# EAGLE design PIC795 Brain Board (EAGLE 6.6.0)
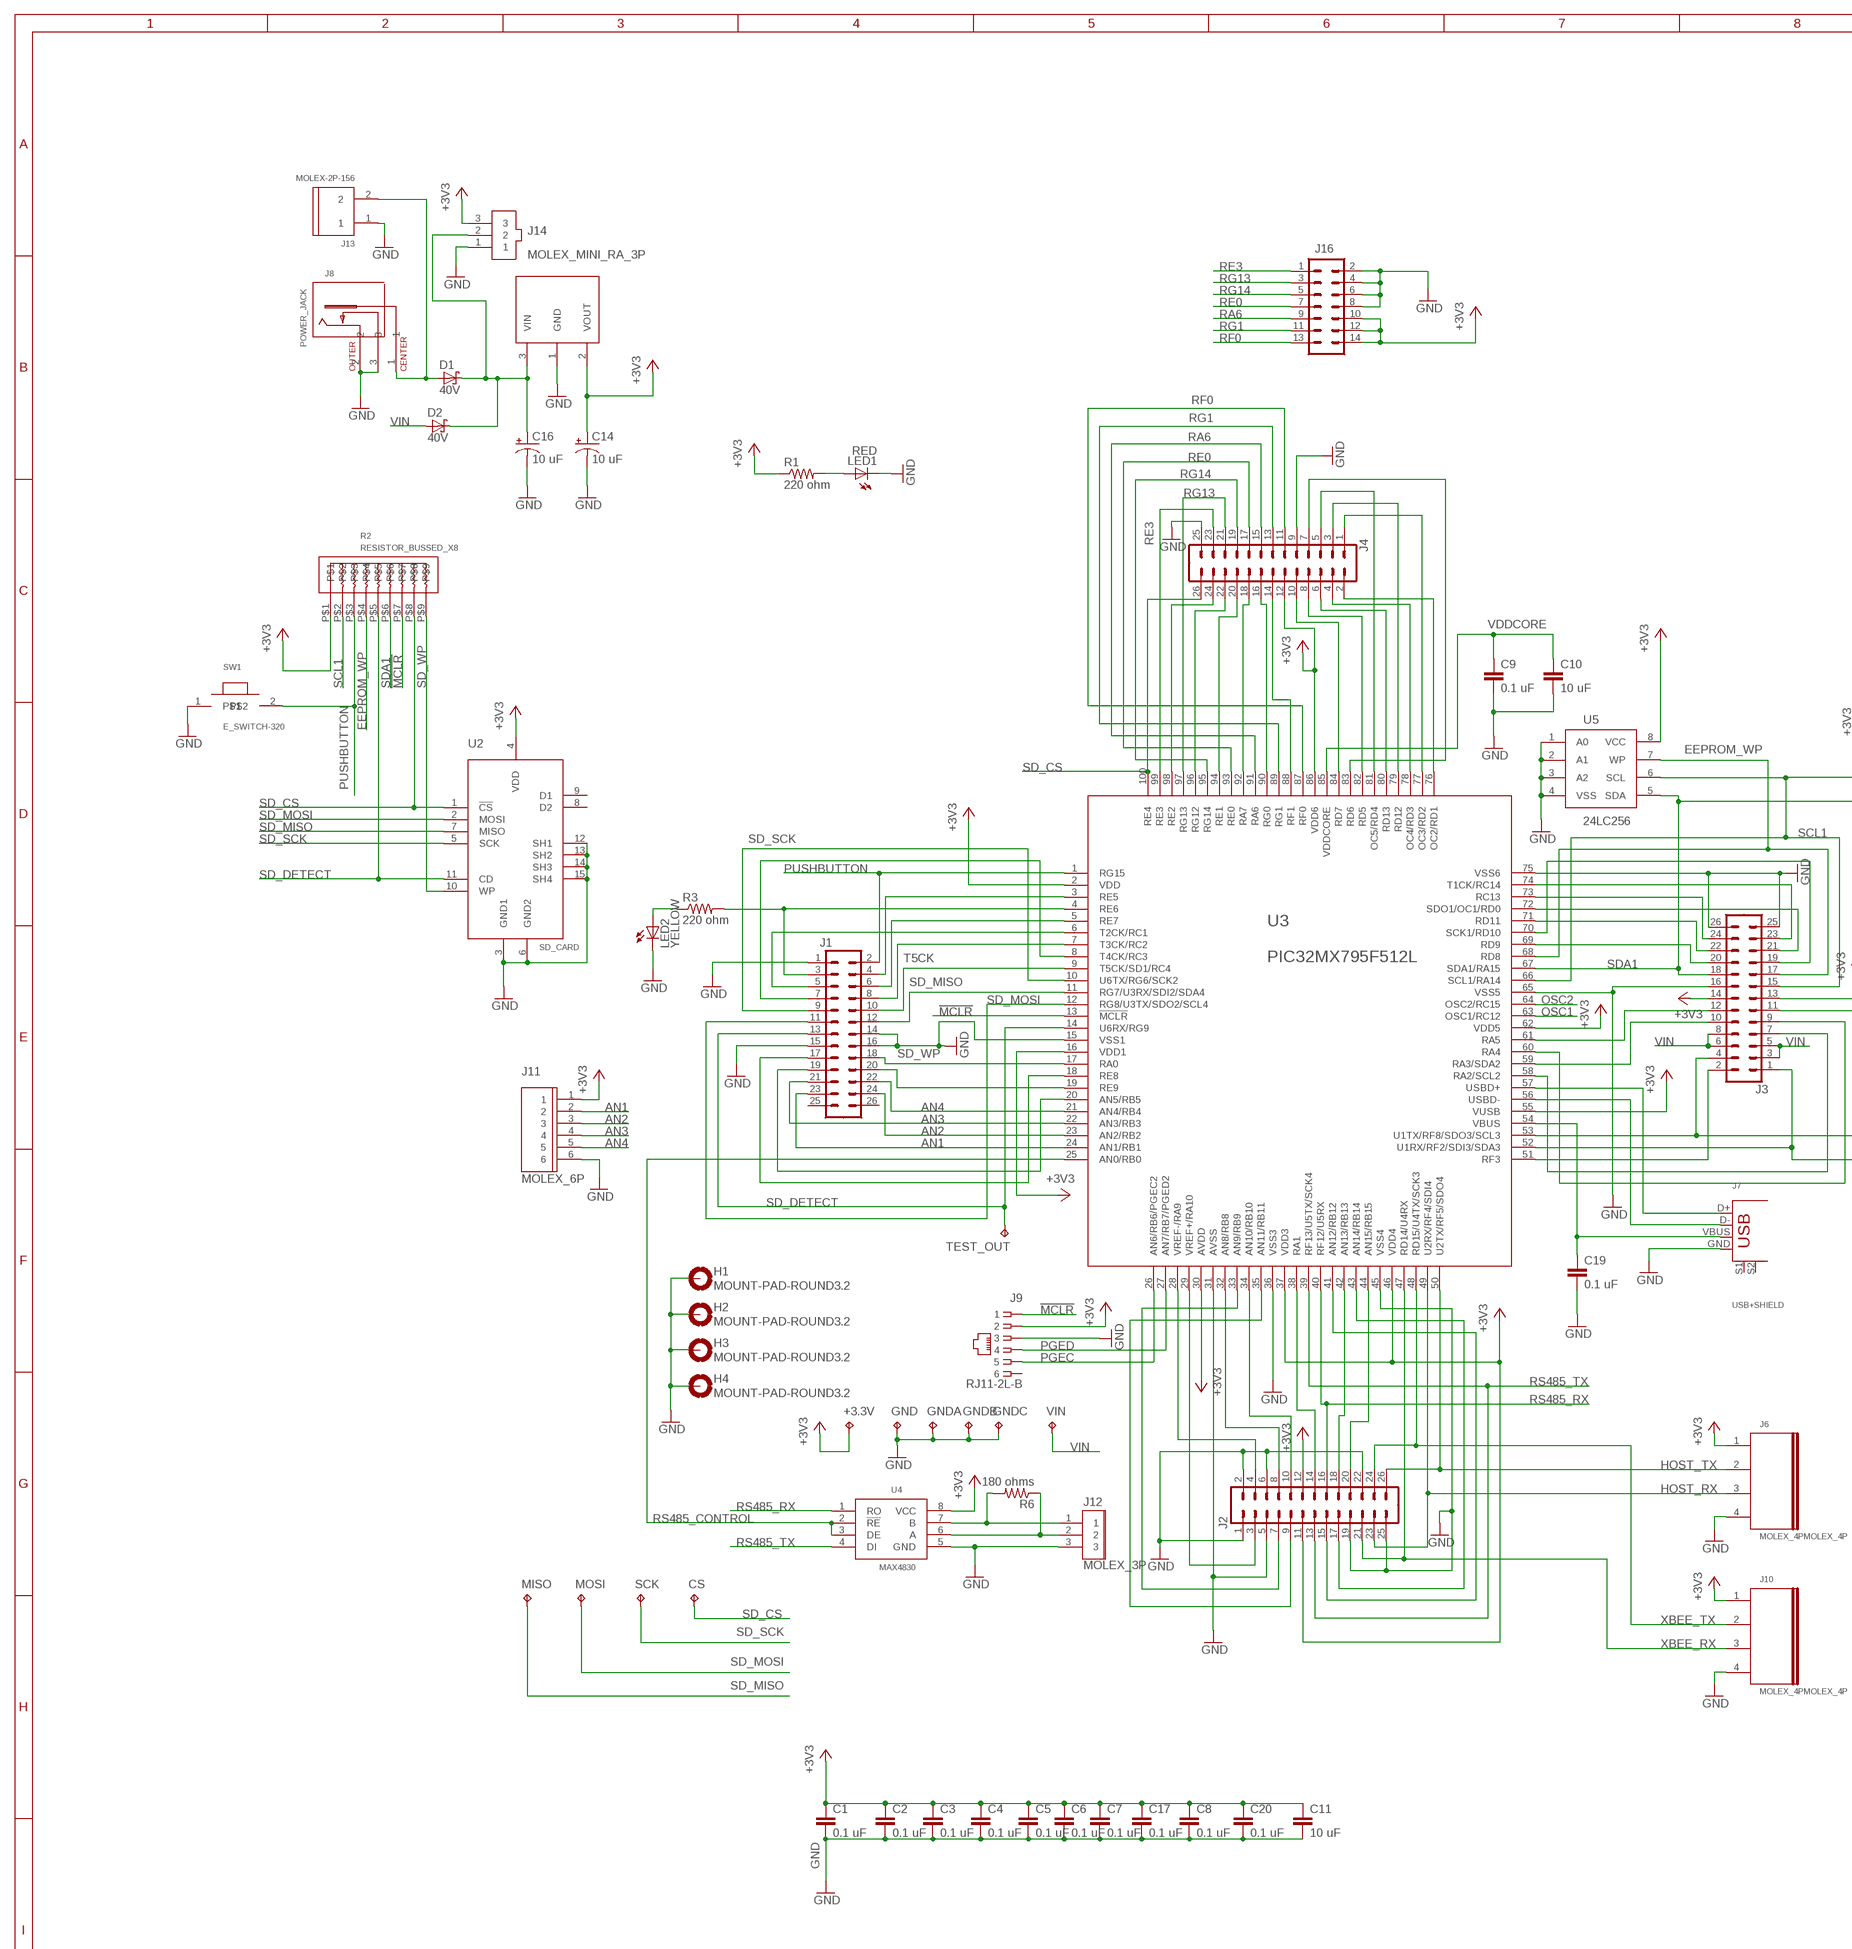
[diagram p0: schematic, sheet 1, part 1 of 2]
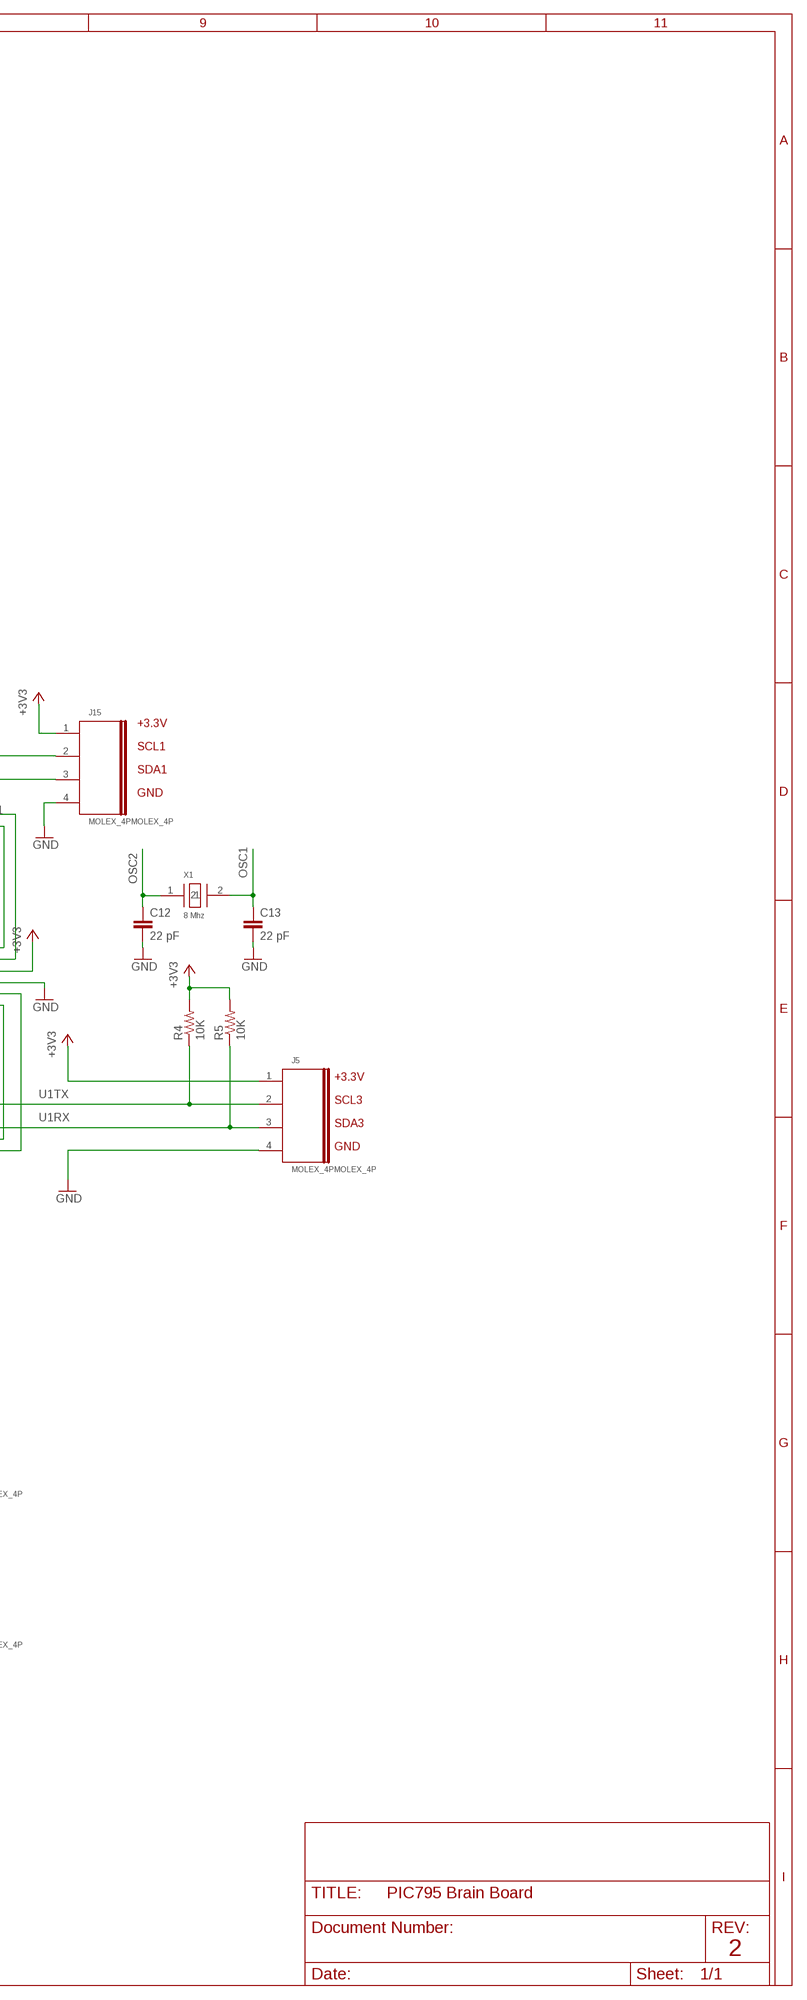
[diagram p1: schematic, sheet 1, part 2 of 2]

## Parts
+3.3V  TP  [TESTPAD]
C1  0.1 uF  CAP-1206  [1206]
C2  0.1 uF  CAP-1206  [1206]
C3  0.1 uF  CAP-1206  [1206]
C4  0.1 uF  CAP-1206  [1206]
C5  0.1 uF  CAP-1206  [1206]
C6  0.1 uF  CAP-1206  [1206]
C7  0.1 uF  CAP-1206  [1206]
C8  0.1 uF  CAP-1206  [1206]
C9  0.1 uF  CAP-1206  [1206]
C10  10 uF  CAP-1206  [1206]
C11  10 uF  CAP-1206  [1206]
C12  22 pF  C0805  [C0805]
C13  22 pF  C0805  [C0805]
C14  10 uF  POLCAPE2.5-5  [E2,5-5]
C16  10 uF  POLCAPE2.5-5  [E2,5-5]
C17  0.1 uF  CAP-1206  [1206]
C19  0.1 uF  C5/2.5  [C5B2.5]
C20  0.1 uF  C5/2.5  [C5B2.5]
CS  TP  [TESTPAD]
D1  40V  1N5817-B  [DO41-7.6]
D2  40V  1N5817-B  [DO41-7.6]
GND  TP  [TESTPAD]
GNDA  TP  [TESTPAD]
GNDB  TP  [TESTPAD]
GNDC  TP  [TESTPAD]
H1  MOUNT-PAD-ROUND3.2  [3,2-PAD]
H2  MOUNT-PAD-ROUND3.2  [3,2-PAD]
H3  MOUNT-PAD-ROUND3.2  [3,2-PAD]
H4  MOUNT-PAD-ROUND3.2  [3,2-PAD]
J1  M13X22X13  [2X13]
J2  M13X22X13  [2X13]
J3  M13X22X13  [2X13]
J4  M13X22X13  [2X13]
J5  MOLEX_4PMOLEX_4P  [MOLEX_4P]
J6  MOLEX_4PMOLEX_4P  [MOLEX_4P]
J7  USB+SHIELD  [USB-B-PTH]
J8  POWER_JACK  [POWER_JACK_PJ-202A]
J9  RJ11-2L-B  [RJ11-NO_SHIELD]
J10  MOLEX_4PMOLEX_4P  [MOLEX_4P]
J11  MOLEX_6P  [MOLEX_6P_SLIM]
J12  MOLEX_3P  [MOLEX_3P]
J13  MOLEX-2P-156  [MOLEX-156-2P]
J14  MOLEX_MINI_RA_3P  [MOLEX_MINI_RA_3P]
J15  MOLEX_4PMOLEX_4P  [MOLEX_4P]
J16  CONNECTOR_DUAL_ROW_14  [2X7]
LED1  RED  LED5MM  [LED5MM]
LED2  YELLOW  LED5MM  [LED5MM]
MISO  TP  [TESTPAD]
MOSI  TP  [TESTPAD]
R1  220 ohm  RESISTOR0207/12  [1/4_WATT]
R2  RESISTOR_BUSSED_X8  [RESISTOR_BUSSED]
R3  220 ohm  RESISTOR0207/12  [1/4_WATT]
R4  10K  RESISTOR0207/12  [1/4_WATT]
R5  10K  RESISTOR0207/12  [1/4_WATT]
R6  180 ohms  RESISTOR0204/7  [0204/7]
SCK  TP  [TESTPAD]
SW1  E_SWITCH-320  [E_SWITCH_320]
TEST_OUT  TP  [TESTPAD]
U1  REGULATOR_LD1086_LDO  [D2PAK]
U2  SD_CARD  [SD_CARD_TE_2041021]
U3  PIC32MX795F512L  [TQFP-100-14X14MM]
U4  MAX4830  MAX485  [SOICN]
U5  24LC256  EEPROM_24LC256  [DIL08]
VIN  TP  [TESTPAD]
X1  8 Mhz  CRYSTAL-SMD  [CRYSTAL-SMD]

## Nets
!MCLR: J9.1 R2.P$7 U3.13(!MCLR)
+3V3: +3.3V.P$1(TP) C1.A C2.A C3.A C4.A C5.A C6.A C7.A C8.A C11.A C14.+ C17.A C20.1 J2.11 J2.12 J3.13 J3.14 J4.12 J5.1 J6.1 J9.2 J10.1 J11.1 J14.3 J15.1 J16.10 J16.12 J16.14 R1.1 R2.P$1 R4.2 R5.2 U1.2(VOUT) U2.4(VDD) U3.2(VDD) U3.16(VDD1) U3.30(AVDD) U3.37(VDD3) U3.46(VDD4) U3.55(VUSB) U3.62(VDD5) U3.86(VDD6) U4.8(VCC) U5.8(VCC)
AN1: J1.23 J11.2 U3.24(AN1/RB1)
AN2: J1.24 J11.3 U3.23(AN2/RB2)
AN3: J1.21 J11.4 U3.22(AN3/RB3)
AN4: J1.22 J11.5 U3.21(AN4/RB4)
EEPROM_WP: J3.17 R2.P$4 U3.68(RD8) U5.7(WP)
GND: C1.C C2.C C3.C C4.C C5.C C6.C C7.C C8.C C9.C C10.C C11.C C12.2 C13.2 C14.- C16.- C17.C C19.2 C20.2 GND.P$1(TP) GNDA.P$1(TP) GNDB.P$1(TP) GNDC.P$1(TP) H1.B3,2(MOUNT) H2.B3,2(MOUNT) H3.B3,2(MOUNT) H4.B3,2(MOUNT) J1.1 J1.14 J1.15 J1.16 J2.1 J2.2 J2.5 J2.6 J2.19 J2.22 J2.25 J3.11 J3.16 J3.25 J3.26 J4.9 J4.25 J5.4 J6.4 J7.GND J8.2 J8.3 J9.3 J10.4 J11.6 J12.3 J13.1 J14.1 J15.4 J16.2 J16.4 J16.6 J16.8 LED1.K(C) LED2.K(C) SW1.1 U1.1(GND) U2.3(GND1) U2.6(GND2) U2.12(SH1) U2.13(SH2) U2.14(SH3) U2.15(SH4) U3.15(VSS1) U3.31(AVSS) U3.36(VSS3) U3.45(VSS4) U3.65(VSS5) U3.75(VSS6) U4.5(GND) U5.1(A0) U5.2(A1) U5.3(A2) U5.4(VSS)
HOST_RX: J2.23 J6.3 U3.49(U2RX/RF4/SDI4)
HOST_TX: J2.26 J6.2 U3.50(U2TX/RF5/SDO4)
N$1: J3.2 U3.51(RF3)
N$2: LED2.A R3.1
N$3: J2.8 U3.32(AN8/RB8)
N$4: J7.D+ U3.57(USBD+)
N$5: J3.10 U3.59(RA3/SDA2)
N$6: J3.12 U3.61(RA5)
N$7: D1.A J8.1 J13.2
N$8: C16.+ D1.C D2.C J14.2 U1.3(VIN)
N$10: J3.20 U3.69(RD9)
N$11: J3.22 U3.71(RD11)
N$12: J3.24 U3.73(RC13)
N$15: C19.1 J7.VBUS U3.54(VBUS)
N$16: J7.D- U3.56(USBD-)
N$17: J3.7 U3.58(RA2/SCL2)
N$18: J3.9 U3.60(RA4)
N$19: J3.23 U3.74(T1CK/RC14)
N$20: J3.21 U3.72(SDO1/OC1/RD0)
N$21: J3.19 U3.70(SCK1/RD10)
N$25: LED1.A R1.2
N$26: J12.1 R6.2 U4.7(B)
N$27: J2.4 U3.28(VREF-/RA9)
N$28: J12.2 R6.1 U4.6(A)
N$30: J2.10 U3.34(AN10/RB10)
N$32: J2.14 U3.38(RA1)
N$34: J2.18 U3.42(AN13/RB13)
N$35: J2.20 U3.44(AN15/RB15)
N$40: J2.3 U3.29(VREF+/RA10)
N$42: J2.7 U3.33(AN9/RB9)
N$43: J2.9 U3.35(AN11/RB11)
N$47: J2.17 U3.43(AN14/RB14)
N$48: J2.15 U3.41(AN12/RB12)
N$51: J4.2 U3.76(OC2/RD1)
N$52: J4.4 U3.78(OC4/RD3)
N$53: J4.6 U3.80(RD13)
N$54: J4.8 U3.82(RD5)
N$55: J4.10 U3.84(RD7)
N$57: J4.14 U3.88(RF1)
N$58: J4.16 U3.90(RG0)
N$59: J4.18 U3.92(RA7)
N$60: J4.20 U3.94(RE1)
N$61: J4.22 U3.96(RG12)
N$62: J4.24 U3.98(RE2)
N$64: J4.1 U3.77(OC3/RD2)
N$65: J4.3 U3.79(RD12)
N$66: J4.5 U3.81(OC5/RD4)
N$67: J4.7 U3.83(RD6)
N$77: J1.4 U3.3(RE5)
N$78: J1.6 U3.5(RE7)
N$79: J1.8 U3.7(T3CK/RC2)
N$85: J1.20 U3.19(RE9)
N$90: J1.3 R3.2 U3.4(RE6)
N$91: J1.5 U3.6(T2CK/RC1)
N$92: J1.7 U3.8(T4CK/RC3)
N$96: J1.19 U3.20(AN5/RB5)
N$97: J1.17 U3.18(RE8)
OSC1: C13.1 U3.63(OSC1/RC12) X1.2
OSC2: C12.1 U3.64(OSC2/RC15) X1.1
PGEC: J9.5 U3.26(AN6/RB6/PGEC2)
PGED: J9.4 U3.27(AN7/RB7/PGED2)
PUSHBUTTON: J1.2 R2.P$3 SW1.2 U3.1(RG15)
RA6: J4.15 J16.9 U3.91(RA6)
RE0: J4.17 J16.7 U3.93(RE0)
RE3: J4.23 J16.1 U3.99(RE3)
RF0: J4.11 J16.13 U3.87(RF0)
RG1: J4.13 J16.11 U3.89(RG1)
RG13: J4.21 J16.3 U3.97(RG13)
RG14: J4.19 J16.5 U3.95(RG14)
RS485_CONTROL: U3.25(AN0/RB0) U4.2(!RE) U4.3(DE)
RS485_RX: J2.16 U3.40(RF12/U5RX) U4.1(RO)
RS485_TX: J2.13 U3.39(RF13/U5TX/SCK4) U4.4(DI)
SCL1: J3.15 J15.2 R2.P$2 U3.66(SCL1/RA14) U5.6(SCL)
SD_CS: CS.P$1(TP) J4.26 R2.P$8 U2.1(!CS) U3.100(RE4)
SD_DETECT: J1.13 R2.P$5 TEST_OUT.P$1(TP) U2.11(CD) U3.14(U6RX/RG9)
SD_MISO: J1.12 MISO.P$1(TP) U2.7(MISO) U3.11(RG7/U3RX/SDI2/SDA4)
SD_MOSI: J1.11 MOSI.P$1(TP) U2.2(MOSI) U3.12(RG8/U3TX/SDO2/SCL4)
SD_SCK: J1.9 SCK.P$1(TP) U2.5(SCK) U3.10(U6TX/RG6/SCK2)
SD_WP: J1.18 R2.P$9 U2.10(WP) U3.17(RA0)
SDA1: J3.18 J15.3 R2.P$6 U3.67(SDA1/RA15) U5.5(SDA)
T5CK: J1.10 U3.9(T5CK/SD1/RC4)
U1RX: J3.1 J5.3 R5.1 U3.52(U1RX/RF2/SDI3/SDA3)
U1TX: J3.4 J5.2 R4.1 U3.53(U1TX/RF8/SDO3/SCL3)
VDDCORE: C9.A C10.A U3.85(VDDCORE)
VIN: D2.A J3.3 J3.5 J3.6 J3.8 VIN.P$1(TP)
XBEE_RX: J2.21 J10.3 U3.47(RD14/U4RX)
XBEE_TX: J2.24 J10.2 U3.48(RD15/U4TX/SCK3)
Unconnected: J1.25 J1.26 J7.S1 J7.S2 J9.6 U2.8(D2) U2.9(D1)

## Notes on the sheet
- +3.3V
- SCL1
- SDA1
- GND
- +3.3V
- SCL3
- SDA3
- GND
- 2

## Library data of the parts
+3.3V CS GND GNDA GNDB GNDC MISO MOSI SCK TEST_OUT VIN = JimLib:TP: Test pad
C1-C11 C17 = JimLib:CAP-1206: CAPACITOR naming: grid - package width
C12 C13 = JimLib:C0805
C14 C16 = JimLib:POLCAP: POLARIZED CAPACITOR, American symbol
C19 C20 = JimLib:C: CAPACITOR naming: grid - package width
D1 D2 = JimLib:1N581*: 1.0A SCHOTTKY BARRIER RECTIFIER Source: http://www.diodes.com/datasheets/ds23001.pdf
H1-H4 = holes:MOUNT-PAD-ROUND: MOUNTING PAD, round
J1-J4 = SparkFun-Connectors:M13X2: 0.1" spaced headers
J5 J6 J10 J15 = JimLib:MOLEX_4P: .100" (2.54mm) Center Header - 3 Pin
J7 = JimLib:USB+SHIELD: USB+Shield USB connector with shield pins connectable
J8 = JimLib:POWER_JACK
J9 = JimLib:RJ11: CORCOM Modular RJ Jacks No Shield Source: www.tycoelectronics.com .. ENG_DS_1654001_1099_RJ_L_0507.pdf; MF: TYCO ELECTRONICS; MPN: RJ11-2L-B; OC_FARNELL: unknown; OC_NEWARK: 83F4463
J11 = JimLib:MOLEX_6P: .100" (2.54mm) Center Header - 3 Pin
J12 = JimLib:MOLEX_3P
J13 = JimLib:MOLEX-2P-156
J14 = JimLib:MOLEX_MINI_RA_3P
J16 = JimLib:CONNECTOR_DUAL_ROW_14: .1" headers, two rows of 8 each
LED1 LED2 = JimLib:LED: LED OSRAM: - CHIPLED LG R971, LG N971, LY N971, LG Q971, LY Q971, LO R971, LY R971 LH N974, LH R974 LS Q976, LO Q976, LY Q976 LO Q996 - Hyper CHIPLED LW Q18S LB Q993, LB Q99A, LB R99A - SideLED LS A670, LO A670, LY A670, LG A670, LP A670 LB A673, LV A673, LT A673, LW A673 LH A674 LY A675 LS A676, LA A676, LO A676, LY A676, LW A676 LS A679, LY A679, LG A679 - Hyper Micro SIDELED® LS Y876, LA Y876, LO Y876, LY Y876 LT Y87S - SmartLED LW L88C, LW L88S LB L89C, LB L89S, LG L890 LS L89K, LO L89K, LY L89K LS L896, LA L896, LO L896, LY L896 - TOPLED LS T670, LO T670, LY T670, LG T670, LP T670 LSG T670, LSP T670, LSY T670, LOP T670, LYG T670 LG T671, LOG T671, LSG T671 LB T673, LV T673, LT T673, LW T673 LH T674 LS T676, LA T676, LO T676, LY T676, LB T676, LH T676, LSB T676, LW T676 LB T67C, LV T67C, LT T67C, LS T67K, LO T67K, LY T67K, LW E67C LS E67B, LA E67B, LO E67B, LY E67B, LB E67C, LV E67C, LT E67C LW T67C LS T679, LY T679, LG T679 LS T770, LO T770, LY T770, LG T770, LP T770 LB T773, LV T773, LT T773, LW T773 LH T774 LS E675, LA E675, LY E675, LS T675 LS T776, LA T776, LO T776, LY T776, LB T776 LHGB T686 LT T68C, LB T68C - Hyper Mini TOPLED® LB M676 - Mini TOPLED Santana® LG M470 LS M47K, LO M47K, LY M47K Source: http://www.osram.convergy.de LUXEON: - LUMILED® LXK2-PW12-R00, LXK2-PW12-S00, LXK2-PW14-U00, LXK2-PW14-V00 LXK2-PM12-R00, LXK2-PM12-S00, LXK2-PM14-U00 LXK2-PE12-Q00, LXK2-PE12-R00, LXK2-PE12-S00, LXK2-PE14-T00, LXK2-PE14-U00 LXK2-PB12-K00, LXK2-PB12-L00, LXK2-PB12-M00, LXK2-PB14-N00, LXK2-PB14-P00, LXK2-PB14-Q00 LXK2-PR12-L00, LXK2-PR12-M00, LXK2-PR14-Q00, LXK2-PR14-R00 LXK2-PD12-Q00, LXK2-PD12-R00, LXK2-PD12-S00 LXK2-PH12-R00, LXK2-PH12-S00 LXK2-PL12-P00, LXK2-PL12-Q00, LXK2-PL12-R00 Source: www.luxeon.com KINGBRIGHT: KA-3528ASYC Source: www.kingbright.com
R1 R3-R6 = JimLib:RESISTOR: RESISTOR, American symbol
R2 = JimLib:RESISTOR_BUSSED_X8
SW1 = JimLib:E_SWITCH-320: Single pole momentary normally off E Switch 320 Series
U1 = JimLib:REGULATOR_LD1086_LDO
U2 = JimLib:SD_CARD
U3 = JimLib:PIC32MX795F512L
U4 = JimLib:MAX485
U5 = JimLib:EEPROM_24LC256
X1 = JimLib:CRYSTAL-SMD

## Board
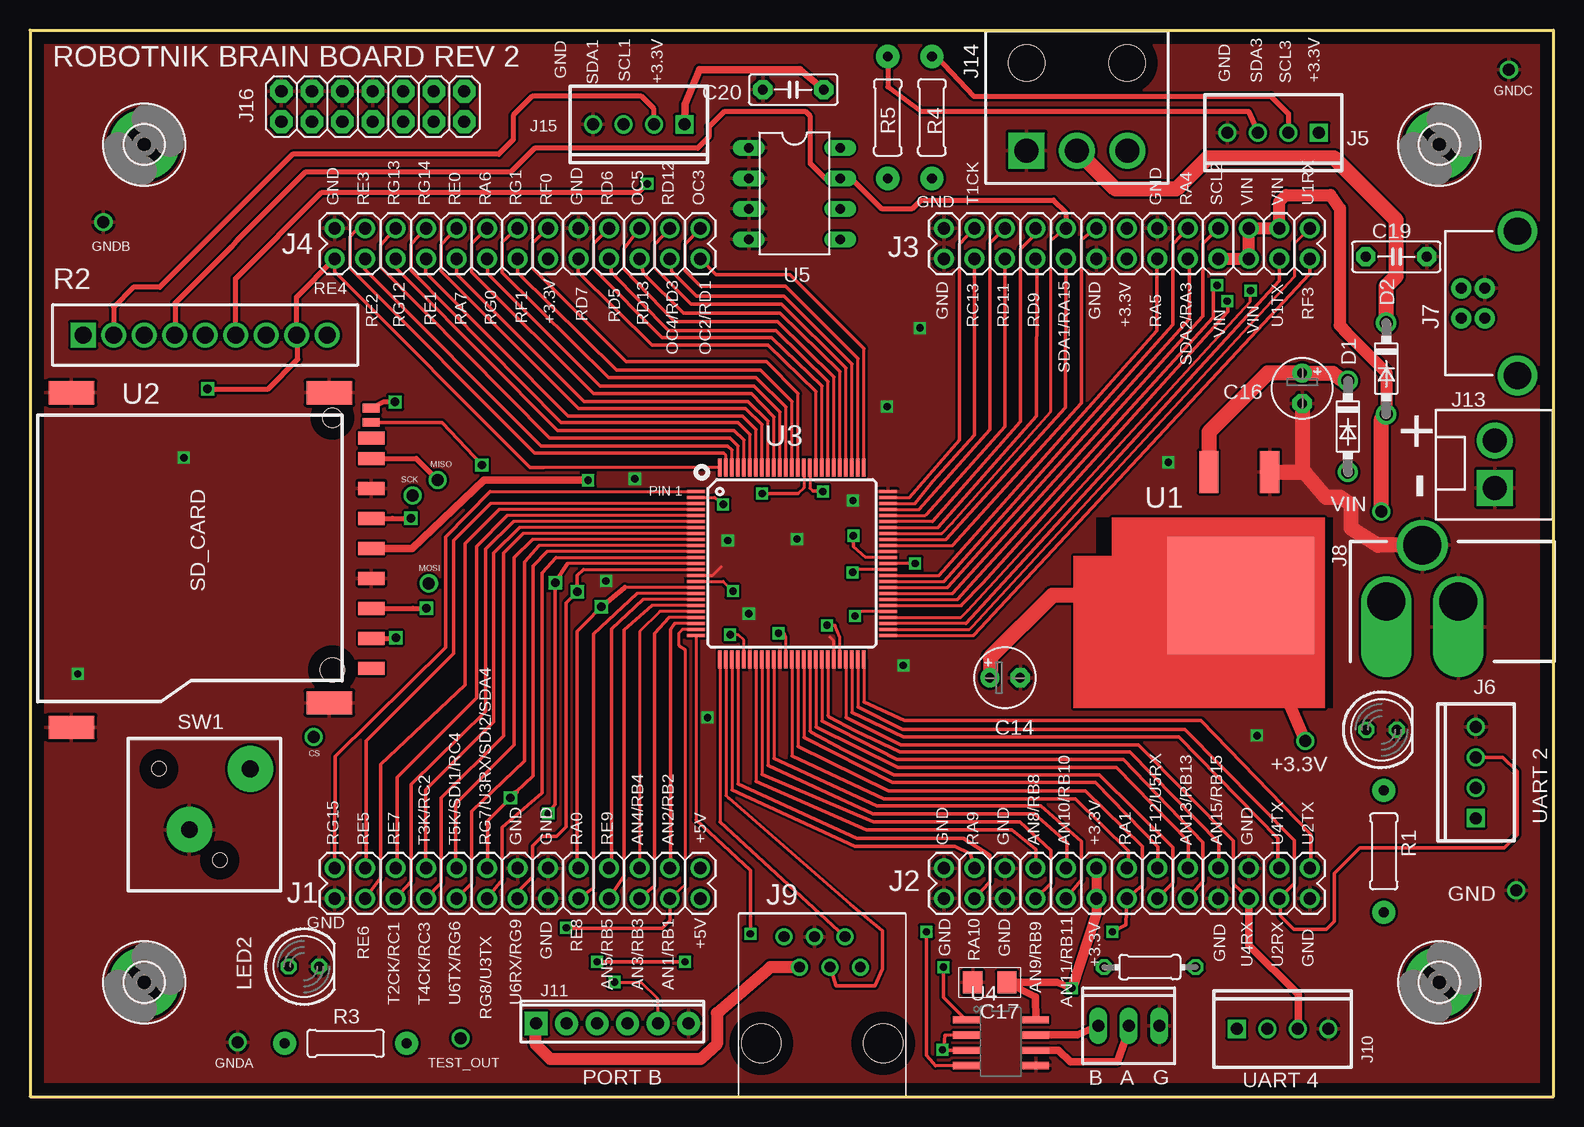
[diagram p2: board, top side]
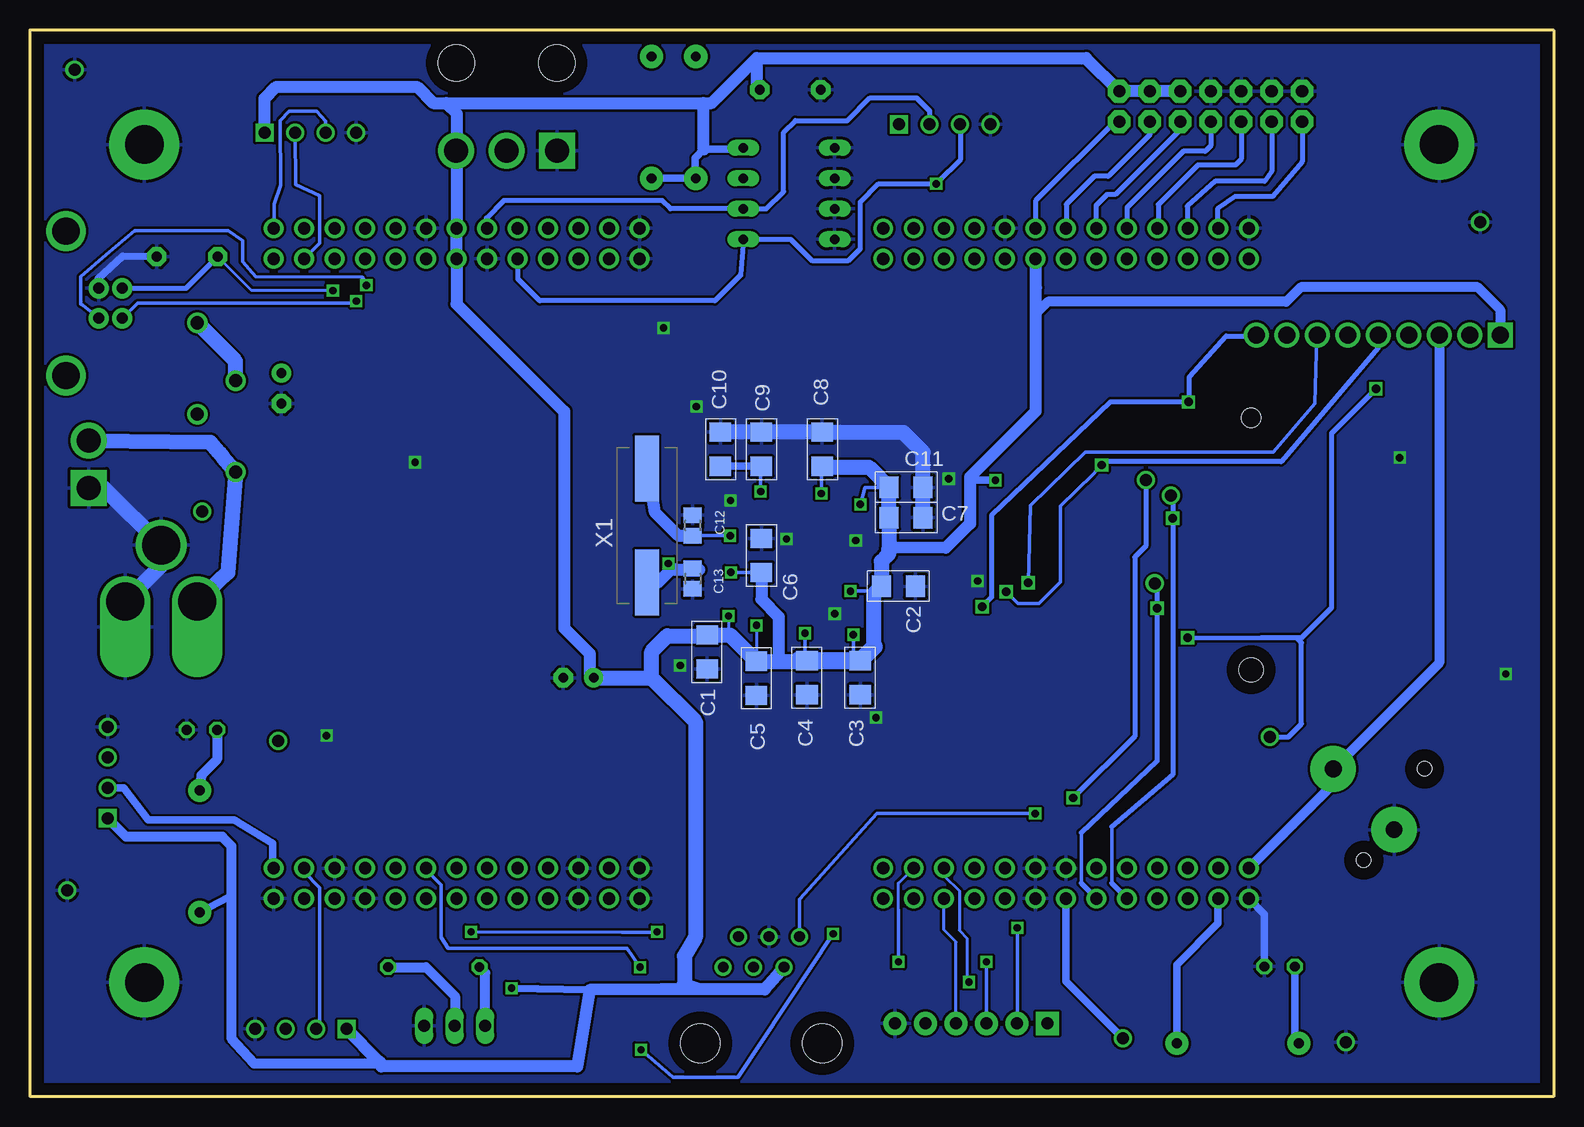
[diagram p3: board, bottom side, seen from below]

Size 127 x 88.93 mm. Coordinates in mm from the lower left corner, seen from the top.
Outline: 127,88.9 127,0 0,0 0,88.9
Outline: 0,88.92 127,88.92
Copper layers (1*16): Top 0.035mm / dielectric 1.5mm / Bottom 0.035mm
Design rules "default *": minimum track width 10mil, minimum drill 19mil, track to track 8mil, track to pad 8mil, pad to pad 8mil, via to via 8mil, smd to smd 8mil, copper to edge 40mil, drill to drill 8mil, minimum pad ring 10mil, minimum via ring 8mil, stop-mask expansion 4mil, vias tented up to drill 0mil, thermal gap 10mil
tRestrict: area 88.9,32.4 to 108.6,48.3

### Footprints (pad centres in the part's own frame; a part is rotated, then mirrored left to right if it is on the bottom)
TESTPAD = drill 1: P$1 0,0
1206 = smd 1.6 x 1.803: A -1.422,0; C 1.422,0
C0805 = smd 1.3 x 1.5: 1 -0.85,0; 2 0.85,0
E2,5-5 = drill 0.813 pad 1.6: + -1.27,0 | drill 0.813 pad 1.6 octagon: - 1.27,0
C5B2.5 = drill 0.813 pad 1.6 octagon: 1 -2.54,0; 2 2.54,0
DO41-7.6 = drill 1.1 pad 1.7: A 3.81,0; C -3.81,0
3,2-PAD = drill 3.2 pad 5.842: B3,2 0,0
2X13 = drill 1.016 pad 1.651: 1 0,0; 2 0,2.54; 3 2.54,0; 4 2.54,2.54; 5 5.08,0; 6 5.08,2.54; 7 7.62,0; 8 7.62,2.54; 9 10.16,0; 10 10.16,2.54; 11 12.7,0; 12 12.7,2.54; 13 15.24,0; 14 15.24,2.54; 15 17.78,0; 16 17.78,2.54; 17 20.32,0; 18 20.32,2.54; 19 22.86,0; 20 22.86,2.54; 21 25.4,0; 22 25.4,2.54; 23 27.94,0; 24 27.94,2.54; 25 30.48,0; 26 30.48,2.54
MOLEX_4P = drill 1 square: 1 -3.81,0 | drill 1: 2 -1.27,0; 3 1.27,0; 4 3.81,0
USB-B-PTH = drill 0.914 pad 1.676: D+ 0,1.25; D- 1.981,1.25; GND 0,-1.25; VBUS 1.981,-1.25 | drill 2.286: S1 -2.718,-6.02; S2 -2.718,6.02
POWER_JACK_PJ-202A = drill 3.2 offset: 1 0,0; 2 0,6 | drill 3.2: 3 -4.7,3
RJ11-NO_SHIELD = drill 0.9 pad 1.4: 1 -3.175,8.89; 2 -1.905,6.35; 3 -0.635,8.89; 4 0.635,6.35; 5 1.905,8.89; 6 3.175,6.35 | hole 3.251: -5.08,0; 5.08,0
MOLEX_6P_SLIM = drill 1 pad 1.93 square: 1 -3.81,0 | drill 1 pad 1.93: 2 -1.27,0; 3 1.27,0; 4 3.81,0; 5 6.35,0; 6 8.89,0
MOLEX_3P = drill 1 long: 1 -2.54,0; 2 0,0; 3 2.54,0
MOLEX-156-2P = drill 2 square: 1 -1.981,0 | drill 2: 2 1.981,0
MOLEX_MINI_RA_3P = drill 2 square: 1 4.2,-2.75 | drill 2: 2 0,-2.75; 3 -4.2,-2.75 | hole 3: 4.191,-10.046; -4.191,-10.046
2X7 = drill 1.016 pad 1.88 octagon: 1 0,0; 2 0,2.54; 3 2.54,0; 4 2.54,2.54; 5 5.08,0; 6 5.08,2.54; 7 7.62,0; 8 7.62,2.54; 9 10.16,0; 10 10.16,2.54; 11 12.7,0; 12 12.7,2.54; 13 15.24,0; 14 15.24,2.54
LED5MM = drill 0.813 octagon: A -1.27,0; K 1.27,0
1/4_WATT = drill 0.813 pad 1.93: 1 -5.08,0; 2 5.08,0
RESISTOR_BUSSED = drill 1.4 square: P$1 0,0 | drill 1.4: P$2 2.54,0; P$3 5.08,0; P$4 7.62,0; P$5 10.16,0; P$6 12.7,0; P$7 15.24,0; P$8 17.78,0; P$9 20.32,0
0204/7 = drill 0.813 octagon: 1 -3.81,0; 2 3.81,0
E_SWITCH_320 = drill 1.4 pad 3.81: 1 -2.54,-2.54; 2 2.54,2.54 | hole 1.2: -5.08,2.54; 0,-5.08
D2PAK = smd 1.6 x 3.5: 1 -2.54,-10.275; 3 2.54,-10.275 | smd 12.2 x 9.75: 2 -0.1,0
SD_CARD_TE_2041021 = smd 1.067 x 2.184: 1 6.88,12.58; 2 4.38,12.58; 3 1.88,12.58; 4 -0.62,12.58; 5 -3.12,12.58; 6 -5.62,12.58; 7 -8.12,12.58; 8 -9.82,12.58; 9 9.38,12.58 | smd 0.711 x 1.422: 10 -12.32,12.58; 11 -11.12,12.58 | smd 1.93 x 3.81: 12 12.255,9.08; 13 14.305,-12.42; 14 -13.595,-12.42; 15 -13.595,9.08 | hole 2: 9.505,9.33 | hole 1.6: -11.495,9.33
TQFP-100-14X14MM = smd 1.5 x 0.27: 1 -8,6; 2 -8,5.5; 3 -8,5; 4 -8,4.5; 5 -8,4; 6 -8,3.5; 7 -8,3; 8 -8,2.5; 9 -8,2; 10 -8,1.5; 11 -8,1; 12 -8,0.5; 13 -8,0; 14 -8,-0.5; 15 -8,-1; 16 -8,-1.5; 17 -8,-2; 18 -8,-2.5; 19 -8,-3; 20 -8,-3.5; 21 -8,-4; 22 -8,-4.5; 23 -8,-5; 24 -8,-5.5; 25 -8,-6; 51 8,-6; 52 8,-5.5; 53 8,-5; 54 8,-4.5; 55 8,-4; 56 8,-3.5; 57 8,-3; 58 8,-2.5; 59 8,-2; 60 8,-1.5; 61 8,-1; 62 8,-0.5; 63 8,0; 64 8,0.5; 65 8,1; 66 8,1.5; 67 8,2; 68 8,2.5; 69 8,3; 70 8,3.5; 71 8,4; 72 8,4.5; 73 8,5; 74 8,5.5; 75 8,6 | smd 0.27 x 1.5: 26 -6,-8; 27 -5.5,-8; 28 -5,-8; 29 -4.5,-8; 30 -4,-8; 31 -3.5,-8; 32 -3,-8; 33 -2.5,-8; 34 -2,-8; 35 -1.5,-8; 36 -1,-8; 37 -0.5,-8; 38 0,-8; 39 0.5,-8; 40 1,-8; 41 1.5,-8; 42 2,-8; 43 2.5,-8; 44 3,-8; 45 3.5,-8; 46 4,-8; 47 4.5,-8; 48 5,-8; 49 5.5,-8; 50 6,-8; 76 6,8; 77 5.5,8; 78 5,8; 79 4.5,8; 80 4,8; 81 3.5,8; 82 3,8; 83 2.5,8; 84 2,8; 85 1.5,8; 86 1,8; 87 0.5,8; 88 0,8; 89 -0.5,8; 90 -1,8; 91 -1.5,8; 92 -2,8; 93 -2.5,8; 94 -3,8; 95 -3.5,8; 96 -4,8; 97 -4.5,8; 98 -5,8; 99 -5.5,8; 100 -6,8
SOICN = smd 0.6 x 2.2: 1 -1.905,-2.9; 2 -0.635,-2.9; 3 0.635,-2.9; 4 1.905,-2.9; 5 1.905,2.9; 6 0.635,2.9; 7 -0.635,2.9; 8 -1.905,2.9
DIL08 = drill 0.813 long: 1 -3.81,-3.81; 2 -1.27,-3.81; 3 1.27,-3.81; 4 3.81,-3.81; 5 3.81,3.81; 6 1.27,3.81; 7 -1.27,3.81; 8 -3.81,3.81
CRYSTAL-SMD = smd 5.5 x 2: 1 -4.75,0; 2 4.75,0

### Placement (x,y rotation side)
+3.3V  106.3,29.67 0 top
C1  70.55,37.07 270 bottom
C2  54.61,42.55 0 bottom
C3  57.78,34.92 270 bottom
C4  62.23,34.92 270 bottom
C5  66.45,34.87 270 bottom
C6  66.04,45.11 90 bottom
C7  53.98,48.26 0 bottom
C8  60.96,53.98 90 bottom
C9  66.04,53.98 90 bottom
C10  69.44,53.98 90 bottom
C11  53.98,50.8 0 bottom
C12  71.75,47.62 90 bottom
C13  71.75,43.18 270 bottom
C14  81.28,34.92 0 top
C16  106.05,59.05 270 top
C17  80.01,9.53 180 top
C19  113.89,70.03 0 top
C20  63.63,83.95 180 top
CS  23.65,29.97 0 top
D1  109.86,55.88 270 top
D2  113.06,60.71 270 top
GND  123.9,17.2 0 top
GNDA  17.32,4.55 0 top
GNDB  6.12,72.9 0 top
GNDC  123.29,85.62 0 top
H1  9.53,9.53 0 top
H2  9.53,79.38 0 top
H3  117.47,9.53 0 top
H4  117.47,79.38 0 top
J1  25.4,16.51 0 top
J2  76.2,16.51 0 top
J3  106.68,72.39 180 top
J4  55.88,72.39 180 top
J5  103.64,80.36 180 top
J6  120.53,27.02 90 top
J7  121.28,66.14 180 top
J8  113.06,41.28 270 top
J9  66.04,4.45 0 top
J10  104.42,5.63 0 top
J11  46,6.1 0 top
J12  91.59,5.91 0 top
J13  122.12,52.73 90 top
J14  87.27,76.12 180 top
J15  50.75,81.05 180 top
J16  20.95,81.28 0 top
LED1  112.67,30.58 0 top
LED2  22.83,10.85 0 top
MISO  33.99,51.41 0 top
MOSI  33.25,42.8 0 top
R1  112.85,20.45 90 top
R2  4.45,63.5 0 top
R3  26.31,4.45 0 top
R4  75.18,81.64 270 top
R5  71.5,81.64 270 top
R6  93.34,10.79 180 top
SCK  31.9,50.11 0 top
SW1  15.82,24.79 0 top
TEST_OUT  35.89,4.85 0 top
U1  100.8,41.8 180 top
U2  15.88,45.09 270 top
U3  63.5,44.45 0 top
U4  80.94,4.5 270 top
U5  63.73,75.29 270 top
VIN  112.65,48.79 0 top
X1  75.56,47.62 270 bottom

### Tracks (layer width: path | path; a pad name or v marks a point on that pad's centre or on a via)
!MCLR  (via drill 0.6, 0.7)
  Top 0.254: U3.13 44.83,44.45
  Top 0.305: 44.83,44.45 v43.79,42.85 43.79,24.36 v43.2,23.6
  Bottom 0.305: v43.2,23.6 56.39,23.6 62.87,16.46 J9.1 | v43.79,42.85 43.61,49.28 39.04,53.75 23.34,53.75 19.89,57.78 19.74,63.45 R2.P$7
+3V3  (via drill 0.6)
  Top 0.254: U3.62 68.72,43.95 v68.58,43.71 | U3.55 69.15,40.45 v68.78,40.08 | U3.2 57.06,49.95 v57.78,49.38 | U3.86 64.5,50.76 64.01,50.27 | U3.16 57.79,42.95 v58.6,42.14 | U3.30 59.5,38.06 59.05,38.51 v58.37,38.51 | U3.37 63,38.27 62.89,38.63 v62.41,38.63 | U3.46 67.5,38.27 67.11,39.29 v66.45,39.29
  Top 0.305: 64.01,50.27 61.06,50.27 v61.04,50.29
  Top 0.61: U4.8 83.81,8.32 C17.A 85.62,9.53 v86.84,9.04 | U2.4 31.86,45.7 37.85,51.38 v46.53,51.38 | J15.1 54.59,82.75 55.8,85.62 64.19,85.62 C20.1
  Top 0.813: J2.12 J2.11 88.9,15.27 v86.84,9.04
  Top 1.016: +3.3V.P$1 101.22,41.48 U1.2 | J9.2 61.72,10.79 57.25,6.96 57.25,4.37 55.88,3.12 43.38,3.12 42.16,4.34 42.16,6.07 J11.1
  Top 1.27: U1.2 85.21,41.8 80.06,36.65 80.06,34.98 C14.+
  Bottom 0.254: v66.45,39.29 C5.A | v68.78,40.08 68.78,39.04 69.34,38.48 C1.A
  Bottom 0.305: 68.55,43.69 v68.58,43.71 68.56,43.69 C6.A | v57.78,49.38 57.4,50.8 C11.A | v58.6,42.14 56.44,42.14 C2.A | v58.37,38.51 58.37,36.93 C3.A | v62.41,38.63 62.41,36.52 C4.A | v61.04,50.29 61.04,52.48 C8.A
  Bottom 0.406: 42.82,67.49 43.18,67.13 | 67.74,78.97 U5.8
  Bottom 0.61: v86.84,9.04 84.68,8.99 80.35,8.9 | 67.74,79.05 U5.8 | R1.1 110.39,16.64 110.21,16.46 | v46.53,51.38 48.54,51.38 48.64,51.49 | 67.74,78.97 70.84,78.97 71.55,78.26 71.55,76.61 R5.2 R4.2
  Bottom 0.813: 97.74,2.77 108.33,2.77 110.21,4.88 110.21,16.46 110.21,20.9 110.97,21.67 118.99,21.67 J6.1 | 97.74,2.77 | 91.42,78.87 J14.3 91.42,78.93 | 43.18,65.23 42.14,66.27 22.28,66.27 21.06,67.49 6.33,67.49 4.45,65.61 R2.P$1
  Bottom 1.016: J9.2 65.76,8.94 66.04,8.97 70.97,8.97 | 70.97,8.97 74.35,8.97 80.35,8.9 81.38,2.52 97.51,2.54 97.74,2.77 97.88,2.91 | 97.88,2.91 J10.1 | 97.71,2.52 97.88,2.91 | J4.12 43.18,67.13 43.18,65.23 43.18,57.12 48.64,51.66 48.64,51.49 48.64,47.78 50.67,45.74 55.35,45.8 55.55,45.7 55.55,45.59 55.56,45.1 | 72.44,9.4 70.97,8.97 | C14.+ 80.35,35.27 80.35,36.94 82.47,39.06 82.47,57.12 91.44,66.09 J3.14 J3.13 91.44,78.87 J14.3 | C6.A 66.04,41.45 64.59,40.01 64.59,36.35 64.64,36.3 | J5.1 107.44,83.21 106.48,84.18 94.74,84.18 93.4,82.83 92.3,82.83 | 92.3,82.83 70.87,82.83 | 70.87,82.83 70.18,82.83 66.42,86.59 | 66.42,86.59 38.96,86.59 J16.14 J16.12 J16.10 | 91.42,78.93 91.42,81.94 92.3,82.83 | 70.84,78.97 70.84,82.8 70.87,82.83 | 66.42,86.59 66.42,84.2 C20.1
  Bottom 1.27: C14.+ 75.18,34.92 | 75.18,34.92 71.53,31.27 71.53,13.28 72.44,11.73 72.44,9.4 | C4.A 62.33,36.45 U3.37 63.15,36.3 64.64,36.3 C5.A 68.63,38.48 C1.A | 75.18,34.92 75.18,37.11 73.89,38.41 70.64,38.41 C1.A | 56.64,37.49 56.64,41.94 C2.A | C2.A 56.03,44.63 55.56,45.1 55.4,45.26 C7.A C11.A 57.07,52.48 61.04,52.48 | C2.A
  Bottom 1.422: 56.64,37.49 C3.A C4.A
AN1  (via drill 0.6)
  Top 0.254: U3.24 54.39,38.95 54.08,38.63 54.08,37.62 54.61,37.26 54.61,17.65 J1.23
  Top 0.305: J1.23 53.34,14.68 52.7,14.05 44.73,14.05 v44.7,14.07
  Bottom 0.305: v44.7,14.07 44.7,6.12 J11.2
AN2  (via drill 0.6)
  Top 0.254: U3.23 53.75,39.45
  Top 0.305: 53.75,39.45 53.39,38.96 53.39,19.71 J1.24 | v47.27,11.23 54.63,11.25 v54.61,11.23
  Bottom 0.254: 54.61,15.57 54.61,17.78 J1.24
  Bottom 0.305: J11.3 v47.27,11.23 | v54.61,11.23 54.61,15.57
AN3
  Top 0.254: U3.22 53.28,39.95
  Top 0.305: 53.28,39.95 52.07,38.63 52.07,17.55 J1.21 50.83,16.48
  Bottom 0.254: J11.4 49.81,12.9 50.83,13.92 50.83,16.48 J1.21
AN4  (via drill 0.6)
  Top 0.254: U3.21 52.52,40.45 50.83,38.76 50.83,19.07 J1.22 | v48.72,9.55 50.93,9.55 52.3,8.18 52.3,6.15 J11.5
  Bottom 0.254: J1.22 50.8,18.39 49.53,17.17 49.53,13.87 48.9,13.18 48.9,9.73 v48.72,9.55
EEPROM_WP
  Top 0.254: U3.68 76.01,46.95 76.86,47.8 85.09,57.12 85.09,71.37 J3.17
  Top 0.406: J3.17 86.33,72.42 86.33,73.74 85.32,74.75 74.27,74.75 73.56,74.04 70.97,74.04 68.45,76.56 U5.7 66.27,76.56 65.05,77.78 65.05,81.74 64.69,82.09 57.84,82.09 56.59,80.85 56.59,80.01 55.65,79.07 42.06,79.07 40.06,77.06 22.94,77.06 17.22,71.35 16.76,70.84 12.09,66.17 12.09,63.52 R2.P$4
GND  (via drill 0.6)
  Top 0.254: U3.15 56.89,43.45 57.63,44.2 | U3.45 67,37.98 66.67,38.3
  Top 1.27: J8.3 112.36,45.98 110.11,47.4 110.11,49.35 109.25,49.99 108.03,49.99 106.3,51.97 106.3,52.05 106.15,52.05 | 106.15,52.05 103.37,52.05 U1.1 | C16.- 106.05,52.15 106.15,52.05
  Bottom 0.61: C19.2 119.25,70.05 121.31,68.2 121.36,67.46 J7.GND | LED2.K 24.11,15.21 J1.1
  Bottom 1.27: J8.2 116.06,44.28 J8.3 120.83,50.75 J13.1 | C11.C C7.C 52.55,53.72 54.2,55.37 60.94,55.37 C8.C C9.C C10.C
  other vias: 48.01,42.98 63.93,46.48 56.49,31.6 71.45,57.53 74.19,64.08 94.89,52.88 102.29,30.1 72.8,35.94 58.17,46.35 68.61,49.71 12.83,53.26 3.99,35.23 50.42,51.51 59.92,40.26
  pour Top: 0,0 0,88.9 127,88.9 127,0
  pour Bottom: 0,0 127,0 127,88.9 0,88.9
HOST_RX
  Top 0.254: U3.49 69,32.5
  Top 0.305: 69,32.5 72.75,30.63 96.27,30.63 105.41,21.36 105.41,17.78 J2.23 104.24,16.41 104.24,15.06 105.36,13.95 108.05,13.95 108.74,14.63 108.74,18.62 110.87,20.75 122.91,20.75 123.98,21.82 123.98,27.1 122.78,28.29 J6.3
HOST_TX
  Top 0.254: U3.50 69.5,32.89
  Top 0.305: 69.5,32.89 72.9,31.37 97.61,31.37 106.76,21.84 106.76,19.13 J2.26
  Bottom 0.61: J6.2 119.2,25.75 117.14,23.06 109.98,23.06 106.76,21.11 106.76,19.13 J2.26
N$1
  Top 0.254: U3.51 78.66,38.45
  Top 0.305: 78.66,38.45 106.7,68.63 106.66,69.83 J3.2
N$2
  Bottom 0.61: R3.1 21.57,4.45 LED2.A
N$3
  Top 0.254: U3.32 60.5,26.27
  Top 0.305: 60.5,26.27 69.72,22.23 81.86,22.23 83.84,20.62 83.84,19.07 J2.8
N$4  (via drill 0.6)
  Top 0.254: U3.57 77.31,41.45
  Top 0.305: 77.31,41.45 77.65,41.81 78.69,42.98 98.63,65 98.63,67.46 v98.96,67.64
  Bottom 0.305: v98.96,67.64 98.91,67.61 99.31,68.3 108.18,68.35 109.27,69.62 109.27,71.35 110.47,72.19 118.26,72.19 | 118.26,72.14 118.26,72.19 | 118.26,72.19 120.65,70.21 122.78,68.35 122.76,66.09 122.59,65.99 J7.D+
N$5
  Top 0.254: U3.59 76.49,42.45
  Top 0.305: 76.49,42.45 96.65,64.82 96.65,69.72 J3.10
N$6
  Top 0.254: U3.61 75.76,43.45
  Top 0.305: 75.76,43.45 93.95,63.88 93.95,69.83 J3.12
N$7
  Bottom 1.27: J8.1 110.52,43.68 D1.A 110.92,53.31 111.28,53.75 111.96,54.56 J13.2
N$8
  Top 1.27: U1.3 98.27,52.09 98.27,55.42 103.17,60.33 C16.+ 106.07,60.3 108.61,60.3 109.53,59.66 D1.C | D2.C 113.06,67.56 113.89,68.4 113.89,73.08 108.71,78.26 98.15,78.26 95.56,75.67 90.48,75.67 J14.2
  Bottom 1.27: D1.C 109.86,61.32 D2.C
N$10
  Top 0.254: U3.69 75.69,47.45
  Top 0.305: 75.69,47.45 83.9,56.74 83.92,70 J3.20
N$11
  Top 0.254: U3.71 74.64,48.45 74.73,48.51
  Top 0.305: J3.22 81.25,69.83 81.25,55.88 74.73,48.51
N$12
  Top 0.254: U3.73 73.78,49.45
  Top 0.305: 73.78,49.45 75.29,51.31 76.4,52.58 78.74,55.14 J3.24
N$15  (via drill 0.6)
  Top 0.254: U3.54 77.62,39.95 78.18,40.54 101.73,66.29 101.73,67.18 v101.75,67.21
  Bottom 0.254: v101.75,67.21 108.53,67.21 C19.1
  Bottom 0.406: J7.VBUS 114,67.39 C19.1
N$16  (via drill 0.6)
  Top 0.254: U3.56 77.63,40.95
  Top 0.305: 77.63,40.95 77.7,41.02 79.4,42.77 99.85,65.43 99.85,66.04 v99.8,66.32
  Bottom 0.305: v99.8,66.32 99.97,66.17 118.02,66.17 J7.D-
N$17
  Top 0.254: U3.58 76.9,41.95
  Top 0.305: 76.9,41.95 97.79,65.08 97.79,71.12 J3.7
N$18
  Top 0.254: U3.60 76.17,42.95
  Top 0.305: 76.17,42.95 95.28,64.36 95.28,71.07 J3.9
N$19
  Top 0.254: U3.74 73.29,49.95
  Top 0.305: 73.29,49.95 77.47,54.74 77.47,71.07 J3.23
N$20
  Top 0.254: U3.72 74.12,48.95
  Top 0.305: 74.12,48.95 80.03,55.6 80.03,71.17 J3.21
N$21
  Top 0.254: 75.23,47.95 74.27,47.95 U3.70
  Top 0.305: J3.19 83.82,71.91 82.55,70.66 82.55,56.26 75.23,47.95
N$25
  Bottom 0.813: LED1.A 111.4,28.12 112.72,26.8 R1.2
N$26
  Top 0.61: U4.7 87.31,5.13 J12.1
  Bottom 0.813: J12.1 89.05,10.31 R6.2
N$27
  Top 0.254: U3.28 58.5,25.57
  Top 0.305: 58.5,25.57 68.76,20.85 77.11,20.85 78.41,20.22 78.72,19.07 J2.4
N$28
  Top 0.61: U4.6 85.75,3.87 86.72,2.92 90.63,2.92 91.67,5.83 J12.2
  Bottom 0.813: R6.1 93.98,10.79 91.57,8.38 91.57,5.93 J12.2
N$30
  Top 0.254: U3.34 61.5,27.63
  Top 0.305: 61.5,27.63 70.26,23.57 83.72,23.57 86.44,21.18 86.44,19.13 J2.10
N$32
  Top 0.254: U3.38 63.5,28.4
  Top 0.305: 63.5,28.4 71.2,24.84 87.15,24.84 91.57,20.47 91.57,19.18 J2.14
N$34
  Top 0.254: U3.42 65.5,30.82
  Top 0.305: 65.5,30.82 72.34,27.46 90.58,27.46 96.55,21.26 96.55,19.07 J2.18
N$35
  Top 0.254: U3.44 66.5,31.77
  Top 0.305: 66.5,31.77 66.62,31.65 68.81,30.5 72.52,28.73 91.67,28.73 99.08,21.16 99.08,19.3 J2.20
N$40
  Top 0.254: U3.29 59,26.09
  Top 0.305: 59,26.09 68.94,21.54 77.83,21.54 80.01,20.12 80.01,17.91 J2.3
N$42
  Top 0.254: U3.33 61,26.86
  Top 0.305: 61,26.86 70.31,22.89 82.53,22.89 85.09,20.55 85.09,17.78 J2.7
N$43
  Top 0.254: U3.35 62,28.2
  Top 0.305: 62,28.2 70.59,24.23 84.28,24.23 87.63,21.29 87.63,18.09 J2.9
N$47
  Top 0.254: U3.43 66,31.31
  Top 0.305: 66,31.31 72.26,28.12 91.14,28.12 97.79,21.21 97.79,17.96 J2.17
N$48
  Top 0.254: U3.41 65,30.48
  Top 0.305: 65,30.48 65.15,30.35 67.77,28.96 72.01,26.82 89.13,26.82 95.25,20.78 95.25,17.83 J2.15
N$51
  Top 0.254: U3.76 69.5,62.38
  Top 0.305: 69.5,62.38 63.35,68.53 57.2,68.53 J4.2
N$52
  Top 0.254: U3.78 68.5,61.09
  Top 0.305: 68.5,61.09 62.84,66.75 55.55,66.75 53.47,68.83 53.47,69.72 J4.4
N$53
  Top 0.254: U3.80 67.5,60.44
  Top 0.305: 67.5,60.44 62.53,65.3 54.48,65.3 51.16,68.61 50.83,69.83 J4.6
N$54
  Top 0.254: U3.82 66.5,59.61
  Top 0.305: 66.5,59.61 62.18,63.88 53.21,63.88 48.49,68.71 48.28,69.83 J4.8
N$55
  Top 0.254: U3.84 65.5,58.78
  Top 0.305: 65.5,58.78 61.52,62.64 51.84,62.64 45.7,68.76 45.7,69.83 J4.10
N$57
  Top 0.254: U3.88 63.5,57.94
  Top 0.305: 63.5,57.94 60.91,60.58 48.9,60.58 40.66,68.71 40.66,69.83 J4.14
N$58
  Top 0.254: U3.90 62.5,57.08
  Top 0.305: 62.5,57.08 60.35,59.23 47.52,59.23 38.15,68.61 38.15,69.8 J4.16
N$59
  Top 0.254: U3.92 61.5,56.3
  Top 0.305: 61.5,56.3 59.87,57.96 46.18,57.96 35.56,68.56 J4.18
N$60
  Top 0.254: U3.94 60.5,55.63
  Top 0.305: 60.5,55.63 59.38,56.74 44.86,56.74 32.99,68.71 33.02,69.83 J4.20
N$61
  Top 0.254: U3.96 59.5,54.75
  Top 0.305: 59.5,54.75 58.7,55.55 43.99,55.55 31.55,68.02 30.43,69.16 30.45,69.65 J4.22
N$62
  Top 0.254: U3.98 58.5,53.9
  Top 0.305: 58.5,53.9 58.14,54.25 42.62,54.25 27.89,68.99 27.89,69.8 J4.24
N$64
  Top 0.254: U3.77 69,61.53
  Top 0.305: 69,61.53 62.97,67.56 55.91,67.56 54.61,68.86 54.61,71.07 J4.1
N$65
  Top 0.254: U3.79 68,60.73
  Top 0.305: 68,60.73 62.66,66.06 55.09,66.06 52.07,69.11 52.07,71.04 J4.3
N$66
  Top 0.254: U3.81 67,59.98
  Top 0.305: 67,59.98 62.31,64.59 53.75,64.59 49.53,68.99 49.53,70.69 J4.5
N$67
  Top 0.254: U3.83 66,59.25
  Top 0.305: 66,59.25 61.82,63.27 52.7,63.27 46.99,69.01 46.99,71.12 J4.7
N$77
  Top 0.254: U3.3 38.4,49.45
  Top 0.305: 38.4,49.45 35.33,46.38 35.33,36.96 28.04,29.67 28.04,19.15 J1.4
N$78
  Top 0.254: U3.5 39.79,48.45
  Top 0.305: 39.79,48.45 37.21,45.87 37.21,33.22 30.61,26.62 30.61,19.18 J1.6
N$79
  Top 0.254: U3.7 40.8,47.45
  Top 0.305: 40.8,47.45 38.66,45.31 38.66,31.24 32.99,25.58 32.99,19.07 J1.8
N$85
  Top 0.254: U3.19 51.1,41.45
  Top 0.305: 51.1,41.45 48.46,38.99 48.46,19.25 J1.20
N$90
  Top 0.254: U3.4 39.12,48.95
  Top 0.305: 39.12,48.95 36.27,46.1 36.27,34.31 29.21,27.71 29.21,18.24 J1.3
  Bottom 0.61: R3.2 31.39,11 27.96,14.43 27.96,16.48 J1.3
N$91
  Top 0.254: U3.6 40.3,47.95
  Top 0.305: 40.3,47.95 38,45.64 38,32.11 31.75,26.01 31.75,17.93 J1.5
N$92
  Top 0.254: U3.8 41.11,46.95
  Top 0.305: 41.11,46.95 39.5,45.34 39.5,30.07 34.27,24.89 34.27,17.8 J1.7
N$96
  Top 0.254: U3.20 51.85,40.95
  Top 0.305: 51.85,40.95 49.53,38.91 49.53,18.39 J1.19
N$97
  Top 0.254: U3.18 50.59,41.95
  Top 0.305: 50.59,41.95 46.97,38.58 46.99,17.4 J1.17
OSC1  (via drill 0.6)
  Top 0.254: v73.79,44.45 U3.63
  Bottom 0.305: 71.21,43.94 v73.79,44.45
  Bottom 1.016: X1.2 74.62,42.88 73.56,43.94 71.21,43.94 C13.1
OSC2  (via drill 0.6)
  Top 0.254: U3.64 69.68,44.95 68.63,45.87
  Top 0.305: 68.63,45.87 v68.63,46.76
  Bottom 0.305: v68.63,46.76 70.02,46.76 C12.1
  Bottom 1.016: X1.1 74.93,48.74 72.97,46.79 71.79,46.79 C12.1
PGEC
  Top 0.254: U3.26 57.5,22.89
  Top 0.305: 57.5,22.89 J9.5
PGED
  Top 0.254: U3.27 58,25.11 58.22,24.89 68.4,16.03
  Top 0.305: 68.4,16.03 71.04,13.82 71.04,10.67 70.43,9.22 67.18,9.22 66.75,10.67 J9.4
PUSHBUTTON
  Top 0.254: 38.35,50.44 54.19,50.44 U3.1
  Top 0.305: J1.2 25.45,28.37 34.65,37.44 34.65,46.66 38.35,50.44
  Bottom 0.813: J1.2 18.36,26.09 SW1.2 9.53,36.17 R2.P$3
RA6
  Top 0.254: U3.91 62,56.67
  Top 0.305: 62,56.67 60.15,58.6 46.97,58.6 36.83,68.73 36.83,71.09 J4.15
  Bottom 0.406: J16.9 31.11,80.62 36.52,75.21 37.21,75.21 38.12,74.3 38.12,72.42 J4.15
RE0
  Top 0.254: U3.93 61,56.02
  Top 0.305: 61,56.02 59.66,57.35 45.72,57.35 34.29,68.81 34.29,71.04 J4.17
  Bottom 0.406: J16.7 28.57,79.27 29.03,78.82 30.86,78.82 35.56,74.12 J4.17
RE3
  Top 0.254: U3.99 58,53.48 57.81,53.67
  Top 0.305: 57.81,53.67 42.06,53.67 26.67,69.09 26.67,71.68 27.33,72.42 27.91,72.42 J4.23
  Bottom 0.406: J16.1 20.95,77.95 23.42,75.03 26.54,75.03 28.02,74.02 28.02,72.47 J4.23
RF0
  Top 0.254: U3.87 64,58.61
  Top 0.305: 64,58.61 61.39,61.29 49.71,61.29 41.91,69.06 41.91,71.14 J4.11
  Bottom 0.406: J16.13 36.58,81.28 43.18,74.68 J4.11
RG1
  Top 0.254: U3.89 63,57.47
  Top 0.305: 63,57.47 60.53,59.94 48.21,59.94 39.37,68.71 39.37,71.22 J4.13
  Bottom 0.406: J16.11 33.66,80.19 37.11,76.73 38.28,76.73 40.62,74.4 40.62,72.42 J4.13
RG13
  Top 0.254: U3.97 59,54.26
  Top 0.305: 59,54.26 58.34,54.91 43.31,54.91 29.21,69.14 29.21,70.99 J4.21
  Bottom 0.406: J16.3 23.5,77.14 24.08,76.3 28.19,76.3 30.53,74.22 30.53,72.44 J4.21
RG14
  Top 0.254: U3.95 60,55.21
  Top 0.305: 60,55.21 59.03,56.19 44.27,56.19 31.75,68.86 31.75,71.07 J4.19
  Bottom 0.406: J16.5 26.04,78.16 26.52,77.67 29.64,77.67 32.94,74.37 32.94,72.47 J4.19
RS485_CONTROL  (via drill 0.6)
  Top 0.254: U3.25 55.5,23.09
  Top 0.305: 55.5,23.09 60.05,18.85 v60.05,13.56 | v76.07,3.91 76.13,3.86 | 76.13,3.86 U4.3 | 76.13,3.86 76.26,5.11 U4.2
  Bottom 0.305: v76.07,3.91 73.38,1.63 68,1.63 v60.05,13.56
RS485_RX  (via drill 0.6)
  Top 0.254: U3.40 64.5,29.94
  Top 0.305: 64.5,29.94 71.91,26.19 88.8,26.19 94,20.8 94,19.07 J2.16 | v76.15,10.79 76.15,8.29 U4.1
  Bottom 0.305: J2.16 93.98,18.92 92.71,17.65 92.71,13.26 92.13,12.37 77.22,12.37 v76.15,10.79
RS485_TX  (via drill 0.6)
  Top 0.254: U3.39 64,29.19
  Top 0.305: 64,29.19 71.58,25.5 87.96,25.5 92.71,20.85 92.71,17.63 J2.13 91.36,14.33 v90.22,13.74 | v74.73,13.74 74.73,3.45 75.26,2.82 75.49,2.59 U4.4
  Bottom 0.305: v90.22,13.74 77.65,13.72 74.98,13.72 v74.73,13.74
SCL1
  Top 0.254: U3.66 76.91,45.95
  Top 0.305: 76.91,45.95 87.63,57.81 87.63,71.45 J3.15
  Top 0.406: J15.2 52.02,82.35 50.98,83.39 41.86,83.39 40.28,81.81 40.28,79.78 39.06,78.56 21.89,78.56 10.82,67.49 8.61,67.49 6.96,65.84 6.96,63.52 R2.P$2
  Bottom 0.406: J3.15 88.95,72.44 88.95,73.25 87.5,74.7 74.3,74.7 73.61,74.02 U5.6 65.63,74.02 64.19,75.46 64.19,80.39 63.2,81.38 58.85,81.38 56.97,83.26 53.09,83.26 52.02,82.19 J15.2
SD_CS  (via drill 0.7)
  Top 0.254: U3.100 42.8,52.45
  Top 0.305: J4.26 25.4,68.78 41.71,52.45 42.73,52.45 42.8,52.45
  Top 0.406: J4.26 22.23,66.67 R2.P$8 22.33,63.4 22.33,61.47 19.86,59 v14.81,59 | U2.1 30.41,38.2 v30.5,38.25
  Bottom 0.406: v30.5,38.25 24.36,38.27 21.44,38.28 | 21.44,38.28 20.98,38.28 18.49,40.77 18.49,55.32 v14.81,59 | CS.P$1 22.12,29.97 21.01,31.09 21.01,37.84 21.44,38.28
SD_DETECT  (via drill 0.7)
  Top 0.254: 46.13,43.94 U3.14
  Top 0.305: U2.11 34.37,56.2 v37.67,52.65 | 46.13,43.94 45.62,43.43 v45.62,42.09 44.68,41.15 44.68,22.48 43.92,21.72 42.7,21.72 41.91,20.9 41.91,18.31 40.64,17.07 J1.13
  Bottom 0.305: v37.67,52.65 38.41,51.87 41.1,49.23 41.1,42.9 42.9,41.1 44.63,41.1 v45.62,42.09
  Bottom 0.406: R2.P$5 14.61,62.43 22.71,52.93 37.41,52.93 v37.67,52.65
  Bottom 0.61: J1.13 40.64,9.6 TEST_OUT.P$1
SD_MISO  (via drill 0.7)
  Top 0.254: U3.11 43.09,45.45
  Top 0.305: 43.09,45.45 41.94,44.22 41.94,26.72 40.53,25.39 | v40.04,24.91 38.12,22.99 38.12,19.07 J1.12
  Top 0.406: U2.7 32.19,53.2 MISO.P$1 | v40.04,24.91 40.53,25.39
  Bottom 0.406: MISO.P$1 33.98,45.9 34.9,44.98 34.9,30.05 v40.04,24.91
SD_MOSI  (via drill 0.7)
  Top 0.254: 43.86,44.95 U3.12
  Top 0.305: 43.86,44.95 42.7,43.64 42.7,25.32 39.37,22.45 39.37,18.09 J1.11
  Top 0.406: U2.2 31.92,40.7 v33.05,40.72
  Bottom 0.305: 39.37,22 39.37,17.78
  Bottom 0.406: 39.37,22 33.05,27.96 v33.05,40.72 33.05,42.8 MOSI.P$1 | 39.37,17.78 J1.11
SD_SCK  (via drill 0.7)
  Top 0.254: U3.10 42.42,45.95
  Top 0.305: 42.42,45.95 41.22,44.58 41.22,27.99 36.83,23.77 36.83,17.78 J1.9
  Top 0.406: U2.5 30.2,48.2 v31.75,48.21
  Bottom 0.305: 36.83,22.5 36.83,17.78
  Bottom 0.406: 36.83,22.5 31.75,26.82 v31.75,48.21 31.75,50.11 SCK.P$1 | 36.83,17.78 J1.9
SD_WP  (via drill 0.7)
  Top 0.254: U3.17 49.58,42.45
  Top 0.305: v47.62,40.85 46.28,39.45 45.62,38.79 45.62,19.15 J1.18
  Top 0.406: v30.43,57.91 30.28,57.94 29.54,57.94 U2.10 | v47.62,40.85 49.58,42.45
  Bottom 0.305: 24.84,63.42 R2.P$9 | 30.38,57.96 v30.43,57.91
  Bottom 0.406: v47.62,40.85 46.84,41.64 46.84,48.46 36.93,57.91 v30.43,57.91 30.33,58.01 | 24.84,63.42 27.3,63.42 30.38,59.97 30.38,57.96
SDA1  (via drill 0.6)
  Top 0.254: U3.67 76.37,46.45
  Top 0.305: 76.37,46.45 86.31,57.45 86.33,69.83 J3.18
  Top 0.406: R2.P$6 17.14,68.2 24.33,75.39 50.75,75.39 v51.46,76.1
  Bottom 0.406: J3.18 86.33,69.82 86.33,69.34 86.33,68.17 84.5,66.34 69.9,66.34 67.77,68.48 U5.5 63.6,71.48 61.82,69.7 58.78,69.7 57.78,70.69 57.78,74.57 56.26,76.1 v51.46,76.1 51.3,76.26 49.4,78.16 49.4,80.97 J15.3
T5CK
  Top 0.254: U3.9 41.88,46.45
  Top 0.305: 41.88,46.45 40.36,44.93 40.36,29.31 35.46,24.41 35.46,19.15 J1.10
U1RX
  Top 0.254: U3.52 78.32,38.95 78.56,39.19 105.44,68.4 105.44,71.14 J3.1
  Top 0.406: R5.1 71.5,84.18 74.27,82.14 101.58,82.14 J5.3
  Bottom 0.305: J5.3 102.36,81.33 103.12,82.17 105.41,82.17 106.15,81.36 106.12,76 106.66,74.42 106.66,72.42 J3.1
U1TX
  Top 0.254: 78.03,39.45 U3.53
  Top 0.305: J3.4 104.14,68.02 78.03,39.45 | U3.53
  Top 0.406: R4.1 75.56,86.72 78.64,83.41 103.45,83.41 104.9,81.97 J5.2
  Bottom 0.305: J5.2 104.85,76.03 102.84,75.11 102.84,71.14 J3.4
VDDCORE  (via drill 0.6)
  Top 0.254: U3.85 65,50.72 65.25,50.47
  Top 0.305: 65.25,50.47 66.06,50.47 v66.09,50.44
  Bottom 0.305: v66.09,50.44 66.09,52.5 C9.A
  Bottom 0.61: C9.A C10.A
VIN
  Top 1.016: J3.8 J3.6 J3.5 J3.3 104.14,74.6 104.7,75.16 108.41,75.16 109.19,74.04 109.17,64.29 109.78,63.65 113.08,60.35 113.08,56.92 D2.A
  Top 1.27: VIN.P$1 112.65,56.49 D2.A
XBEE_RX
  Top 0.254: U3.47 68,31.62
  Top 0.305: 68,31.62 72.59,29.34 92.41,29.34 100.33,21.31 100.33,17.75 J2.21
  Top 0.61: J2.21 101.6,12.62 105.72,8.51 105.72,5.67 J10.3
XBEE_TX
  Top 0.254: U3.48 68.5,32.03
  Top 0.305: 68.5,32.03 72.8,30 95.76,30 104.04,21.51 104.04,19.15 J2.24
  Bottom 0.305: J2.24 104.14,18.75 102.87,17.42 102.87,5.91 J10.2
(copper drawn outside any net)
  shapes: Top area x2

### Text on the board
tSilk: GND | SCL1 | GND | SDA3 | +3.3V | SDA1 | +3.3V | SCL3 | GND | GND | RE3 | RG13 | RG14 | RE0 | RA6 | RG1 | RF0 | GND | RD6 | OC5 | RD12 | OC3 | T1CK | GND | RA4 | SCL2 | VIN | VIN | U1RX | RE4 | RD7 | RD5 | GND | GND | RF3 | RE2 | RG12 | RE1 | RA7 | RG0 | RF1 | +3.3V | RD13 | RC13 | RD11 | RD9 | +3.3V | RA5 | VIN | U1TX | VIN | OC4/RD3 | OC2/RD1 | SDA2/RA3 | SDA1/RA15 | + | - | UART 2 | RG15 | RE5 | RE7 | T3K/RC2 | T5K/SDI1/RC4 | RG7/U3RX/SDI2/SDA4 | GND | GND | RA0 | RE9 | AN4/RB4 | AN2/RB2 | +5V | GND | RA9 | GND | AN8/RB8 | AN10/RB10 | +3.3V | RA1 | RF12/U5RX | AN13/RB13 | AN15/RB15 | GND | U4TX | U2TX | GND | GND | RE8 | +5V | GND | GND | RE6 | GND | RA10 | +3.3V | U4RX | U2RX | GND | AN5/RB5 | AN3/RB3 | AN1/RB1 | AN9/RB9 | T2CK/RC1 | T4CK/RC3 | U6TX/RG6 | U6RX/RG9 | AN11/RB11 | RG8/U3TX | UART 4 | PORT B | B | A | G
_tsilk: ROBOTNIK BRAIN BOARD REV 2 | PIN 1